# Altium schematic sheet Buck.SchDoc
size 985 x 607 mm
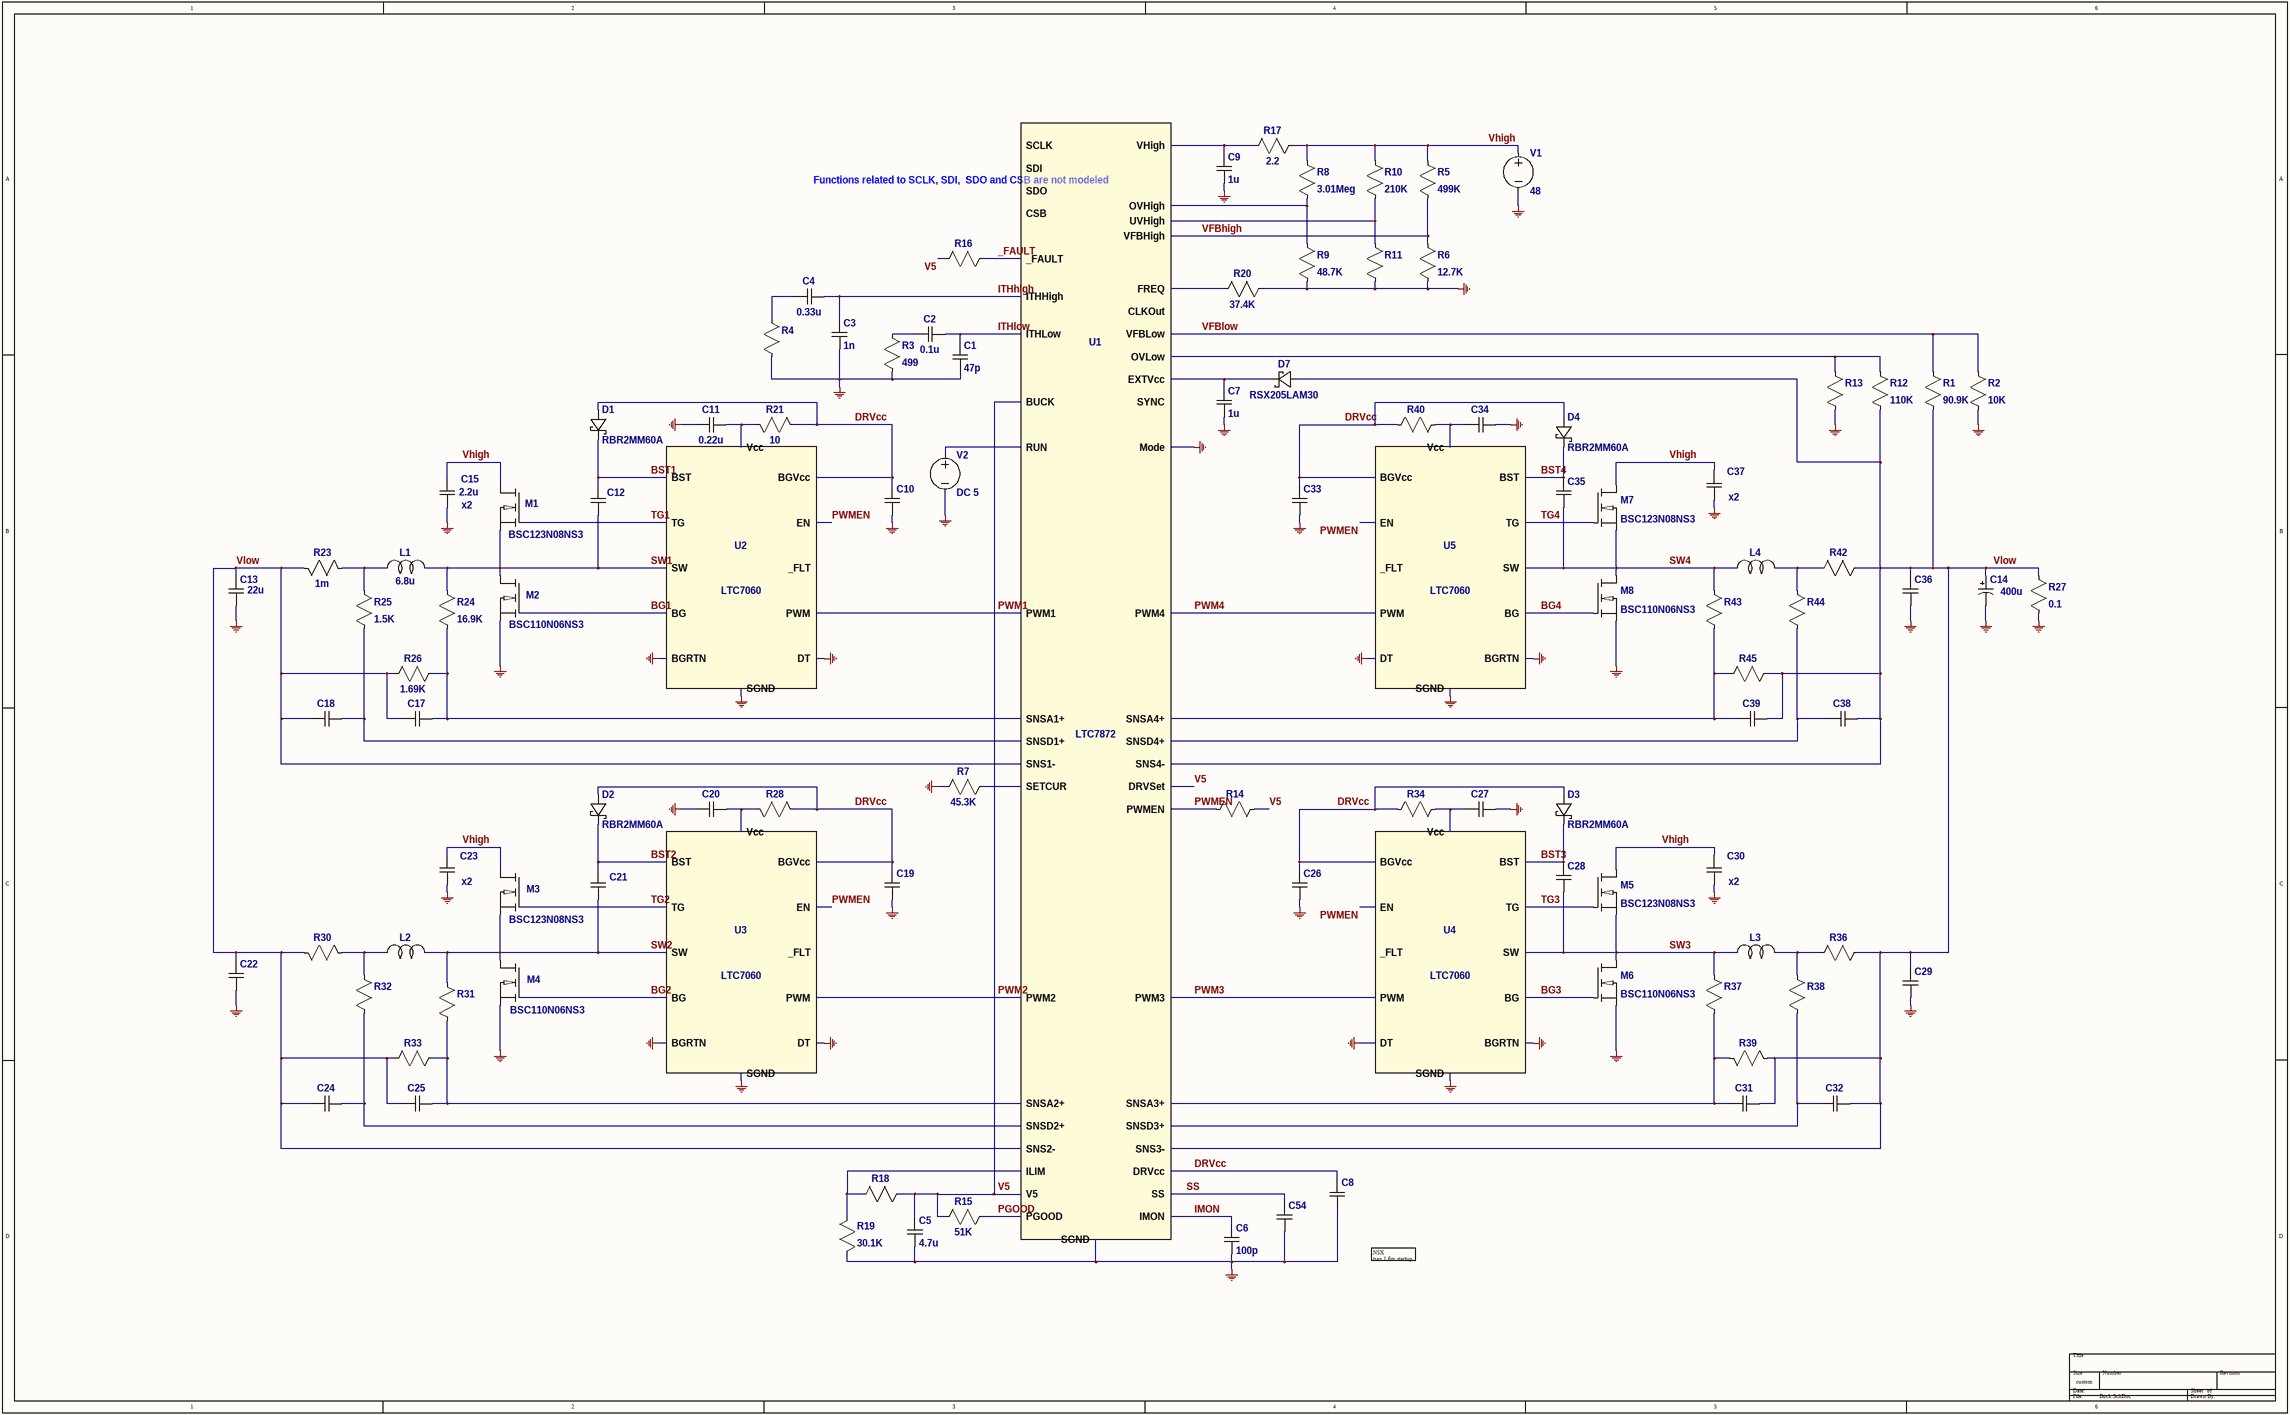
[diagram p0: Buck.SchDoc]

## Parts
C1  47p
C2  0.1u
C3  1n
C4  0.33u
C5  4.7u
C6  100p
C7  1u
C8  4.7u  (value not drawn)
C9  1u
C10  1u  (value not drawn)
C11  0.22u
C12  0.22u  (value not drawn)
C13  22u
C14  400u
C15  2.2u  Value2: x2
C17  0.1u  (value not drawn)
C18  0.1u  (value not drawn)
C19  1u  (value not drawn)
C20  0.22u  (value not drawn)
C21  0.22u  (value not drawn)
C22  22u  (value not drawn)
C23  Value2: x2  (hidden comment: 2.2u)
C24  0.1u  (value not drawn)
C25  0.1u  (value not drawn)
C26  1u  (value not drawn)
C27  0.22u  (value not drawn)
C28  0.22u  (value not drawn)
C29  22u  (value not drawn)
C30  Value2: x2  (hidden comment: 2.2u)
C31  0.1u  (value not drawn)
C32  0.1u  (value not drawn)
C33  1u  (value not drawn)
C34  0.22u  (value not drawn)
C35  0.22u  (value not drawn)
C36  22u  (value not drawn)
C37  Value2: x2  (hidden comment: 2.2u)
C38  0.1u  (value not drawn)
C39  0.1u  (value not drawn)
C54  1n  (value not drawn)
D1  RBR2MM60A
D2  RBR2MM60A
D3  RBR2MM60A
D4  RBR2MM60A
D7  RSX205LAM30
L1  6.8u
L2  6.8u  (value not drawn)
L3  6.8u  (value not drawn)
L4  6.8u  (value not drawn)
M1  BSC123N08NS3
M2  BSC110N06NS3
M3  BSC123N08NS3
M4  BSC110N06NS3
M5  BSC123N08NS3
M6  BSC110N06NS3
M7  BSC123N08NS3
M8  BSC110N06NS3
R1  90.9K
R2  10K
R3  499
R4  499  (value not drawn)
R5  499K
R6  12.7K
R7  45.3K
R8  3.01Meg
R9  48.7K
R10  210K
R11  10K  (value not drawn)
R12  110K
R13  10K  (value not drawn)
R14  10K  (value not drawn)
R15  51K
R16  51K  (value not drawn)
R17  2.2
R18  10K  (value not drawn)
R19  30.1K
R20  37.4K
R21  10
R23  1m
R24  16.9K
R25  1.5K
R26  1.69K
R27  0.1
R28  10  (value not drawn)
R30  1m  (value not drawn)
R31  16.9K  (value not drawn)
R32  1.5K  (value not drawn)
R33  1.69K  (value not drawn)
R34  10  (value not drawn)
R36  1m  (value not drawn)
R37  16.9K  (value not drawn)
R38  1.5K  (value not drawn)
R39  1.69K  (value not drawn)
R40  10  (value not drawn)
R42  1m  (value not drawn)
R43  16.9K  (value not drawn)
R44  1.5K  (value not drawn)
R45  1.69K  (value not drawn)
U1  LTC7872  [LXE_05-08-1832_ADI]
U2  LTC7060  [MSOP12_MSE_ADI]
U3  LTC7060  [MSOP12_MSE_ADI]
U4  LTC7060  [MSOP12_MSE_ADI]
U5  LTC7060  [MSOP12_MSE_ADI]
V1  48
V2  DC 5

## Nets
GND: C1.2(B) C3.2(B) C5.2(B) C6.2(B) C7.2(B) C8.2(B) C9.2(B) C10.2(B) C11.2(B) C13.2(B) C14.2(B) C15.2(B) C19.2(B) C20.2(B) C22.2(B) C23.2(B) C26.2(B) C27.2(B) C29.2(B) C30.2(B) C33.2(B) C34.2(B) C36.2(B) C37.2(B) C54.2(B) M2.3(S) M4.3(S) M6.3(S) M8.3(S) R2.2(B) R3.2(B) R4.2(B) R6.2(B) R7.2(B) R9.2(B) R11.2(B) R13.2(B) R19.1(A) R20.1(A) R27.2(B) U1.4(SGND) U1.37(Mode) U2.4(DT) U2.7(BGRTN) U2.12(SGND) U3.4(DT) U3.7(BGRTN) U3.12(SGND) U4.4(DT) U4.7(BGRTN) U4.12(SGND) U5.4(DT) U5.7(BGRTN) U5.12(SGND) V1.2(-) V2.2(-)
_FAULT: R16.1(A) U1.25(_FAULT)
BG1: M2.2(G) U2.8(BG)
BG2: M4.2(G) U3.8(BG)
BG3: M6.2(G) U4.8(BG)
BG4: M8.2(G) U5.8(BG)
BST1: C12.1(A) D1.2(-) U2.11(BST)
BST2: C21.1(A) D2.2(-) U3.11(BST)
BST3: C28.1(A) D3.2(-) U4.11(BST)
BST4: C35.1(A) D4.2(-) U5.11(BST)
DRVcc: C8.1(A) C10.1(A) C19.1(A) C26.1(A) C33.1(A) D1.1(+) D2.1(+) D3.1(+) D4.1(+) R21.1(A) R28.1(A) R34.1(A) R40.1(A) U1.33(DRVcc) U2.6(BGVcc) U3.6(BGVcc) U4.6(BGVcc) U5.6(BGVcc)
IMON: C6.1(A) U1.8(IMON)
ITHhigh: C3.1(A) C4.1(A) U1.5(ITHHigh)
ITHlow: C1.1(A) C2.1(A) U1.3(ITHLow)
PGOOD: R15.1(A) U1.22(PGOOD)
PWM1: U1.21(PWM1) U2.1(PWM)
PWM2: U1.23(PWM2) U3.1(PWM)
PWM3: U1.24(PWM3) U4.1(PWM)
PWM4: U1.26(PWM4) U5.1(PWM)
PWMEN: R14.1(A) U1.20(PWMEN) U2.2(EN) U3.2(EN) U4.2(EN) U5.2(EN)
SS: C54.1(A) U1.1(SS)
SW1: C12.2(B) L1.1(A) M1.3(S) M2.1(D) R24.1(A) U2.9(SW)
SW2: C21.2(B) L2.1(A) M3.3(S) M4.1(D) R31.1(A) U3.9(SW)
SW3: C28.2(B) L3.1(A) M5.3(S) M6.1(D) R37.1(A) U4.9(SW)
SW4: C35.2(B) L4.1(A) M7.3(S) M8.1(D) R43.1(A) U5.9(SW)
TG1: M1.2(G) U2.10(TG)
TG2: M3.2(G) U3.10(TG)
TG3: M5.2(G) U4.10(TG)
TG4: M7.2(G) U5.10(TG)
V5: C5.1(A) R14.2(B) R15.2(B) R16.2(B) R18.1(A) U1.7(V5) U1.32(DRVSet) U1.40(BUCK)
VFBhigh: R5.2(B) R6.1(A) U1.6(VFBHigh)
VFBlow: R1.1(A) R2.1(A) U1.2(VFBLow)
Vhigh: C15.1(A) C23.1(A) C30.1(A) C37.1(A) M1.1(D) M3.1(D) M5.1(D) M7.1(D) R5.1(A) R8.1(A) R10.1(A) R17.1(A) V1.1(+)
Vlow: C13.1(A) C14.1(A) C17.2(B) C18.2(B) C22.1(A) C24.2(B) C25.2(B) C29.1(A) C31.2(B) C32.2(B) C36.1(A) C38.1(A) C39.1(A) D7.1(+) R1.2(B) R12.2(B) R23.1(A) R26.2(B) R27.1(A) R30.1(A) R33.2(B) R36.1(A) R39.2(B) R42.1(A) R45.1(A) U1.14(SNS1-) U1.17(SNS2-) U1.42(SNS3-) U1.45(SNS4-)
NetC2_2: C2.2(B) R3.1(A)
NetC4_2: C4.2(B) R4.1(A)
NetC7_1: C7.1(A) D7.2(-) U1.31(EXTVcc)
NetC9_1: C9.1(A) R17.2(B) U1.34(VHigh)
NetC11_1: C11.1(A) R21.2(B) U2.5(Vcc)
NetC17_1: C17.1(A) R24.2(B) R26.1(A) U1.13(SNSA1+)
NetC18_1: C18.1(A) R25.2(B) U1.15(SNSD1+)
NetC20_1: C20.1(A) R28.2(B) U3.5(Vcc)
NetC24_1: C24.1(A) R32.2(B) U1.16(SNSD2+)
NetC25_1: C25.1(A) R31.2(B) R33.1(A) U1.18(SNSA2+)
NetC27_1: C27.1(A) R34.2(B) U4.5(Vcc)
NetC31_1: C31.1(A) R37.2(B) R39.1(A) U1.41(SNSA3+)
NetC32_1: C32.1(A) R38.2(B) U1.43(SNSD3+)
NetC34_1: C34.1(A) R40.2(B) U5.5(Vcc)
NetC38_2: C38.2(B) R44.2(B) U1.44(SNSD4+)
NetC39_2: C39.2(B) R43.2(B) R45.2(B) U1.46(SNSA4+)
NetL1_2: L1.2(B) R23.2(B) R25.1(A)
NetL2_2: L2.2(B) R30.2(B) R32.1(A)
NetL3_2: L3.2(B) R36.2(B) R38.1(A)
NetL4_2: L4.2(B) R42.2(B) R44.1(A)
NetR7_1: R7.1(A) U1.9(SETCUR)
NetR8_2: R8.2(B) R9.1(A) U1.10(OVHigh)
NetR10_2: R10.2(B) R11.1(A) U1.11(UVHigh)
NetR12_1: R12.1(A) R13.1(A) U1.12(OVLow)
NetR18_2: R18.2(B) R19.2(B) U1.35(ILIM)
NetR20_2: R20.2(B) U1.39(FREQ)
NetU1_19: U1.19(RUN) V2.1(+)

Not connected (* = marked no-connect by the designer): U1 27(CSB) 28(SDO) 29(SDI) 30(SCLK) 36(CLKOut) 38(SYNC); U2 3(_FLT); U3 3(_FLT); U4 3(_FLT); U5 3(_FLT)

## Notes on the sheet
- (near U1) Functions related to SCLK, SDI,
  SDO and CSB are not modeled
- .NSX
  .tran 1.6m startup

## Library data of the parts
C1 = cap-47p: InstName: C1; Prefix: C; Value: 47p
C2 = cap-0.1u: InstName: C2; Prefix: C; Value: 0.1u
C3 = cap-1n: InstName: C3; Prefix: C; Value: 1n
C4 = cap-0.33u: InstName: C4; Prefix: C; Value: 0.33u
C5 = cap-4.7u: InstName: C5; Prefix: C; Value: 4.7u
C6 = cap-100p: InstName: C6; Prefix: C; Value: 100p
C7 = cap-1u: InstName: C7; Prefix: C; Value: 1u
C8 = cap-4.7u: InstName: C8; Prefix: C; Value: 4.7u
C9 = cap-1u: InstName: C9; Prefix: C; Value: 1u
C10 = cap-1u: InstName: C10; Prefix: C; Value: 1u
C11 = cap-0.22u: InstName: C11; Prefix: C; Value: 0.22u
C12 = cap-0.22u: InstName: C12; Prefix: C; Value: 0.22u
C13 = cap-22u: InstName: C13; Prefix: C; Value: 22u; SpiceLine: Rser=2m
C14 = polcap-400u: InstName: C14; Prefix: C; Description: Capacitor; Type: cap; Value: 400u; SpiceLine: Rser=0.015
C15 = cap-2.2u: InstName: C15; Prefix: C; Value: 2.2u; SpiceLine: Rser=0.014
C17 = cap-0.1u: InstName: C17; Prefix: C; Value: 0.1u
C18 = cap-0.1u: InstName: C18; Prefix: C; Value: 0.1u
C19 = cap-1u: InstName: C19; Prefix: C; Value: 1u
C20 = cap-0.22u: InstName: C20; Prefix: C; Value: 0.22u
C21 = cap-0.22u: InstName: C21; Prefix: C; Value: 0.22u
C22 = cap-22u: InstName: C22; Prefix: C; Value: 22u; SpiceLine: Rser=2m
C23 = cap-2.2u: InstName: C23; Prefix: C; Value: 2.2u; SpiceLine: Rser=0.014
C24 = cap-0.1u: InstName: C24; Prefix: C; Value: 0.1u
C25 = cap-0.1u: InstName: C25; Prefix: C; Value: 0.1u
C26 = cap-1u: InstName: C26; Prefix: C; Value: 1u
C27 = cap-0.22u: InstName: C27; Prefix: C; Value: 0.22u
C28 = cap-0.22u: InstName: C28; Prefix: C; Value: 0.22u
C29 = cap-22u: InstName: C29; Prefix: C; Value: 22u; SpiceLine: Rser=2m
C30 = cap-2.2u: InstName: C30; Prefix: C; Value: 2.2u; SpiceLine: Rser=0.014
C31 = cap-0.1u: InstName: C31; Prefix: C; Value: 0.1u
C32 = cap-0.1u: InstName: C32; Prefix: C; Value: 0.1u
C33 = cap-1u: InstName: C33; Prefix: C; Value: 1u
C34 = cap-0.22u: InstName: C34; Prefix: C; Value: 0.22u
C35 = cap-0.22u: InstName: C35; Prefix: C; Value: 0.22u
C36 = cap-22u: InstName: C36; Prefix: C; Value: 22u; SpiceLine: Rser=2m
C37 = cap-2.2u: InstName: C37; Prefix: C; Value: 2.2u; SpiceLine: Rser=0.014
C38 = cap-0.1u: InstName: C38; Prefix: C; Value: 0.1u
C39 = cap-0.1u: InstName: C39; Prefix: C; Value: 0.1u
C54 = cap-1n: InstName: C54; Prefix: C; Value: 1n
D1 = schottky-RBR2MM60A: InstName: D1; Prefix: D; Description: Diode; Value: RBR2MM60A; Type: diode
D2 = schottky-RBR2MM60A: InstName: D2; Prefix: D; Description: Diode; Value: RBR2MM60A; Type: diode
D3 = schottky-RBR2MM60A: InstName: D3; Prefix: D; Description: Diode; Value: RBR2MM60A; Type: diode
D4 = schottky-RBR2MM60A: InstName: D4; Prefix: D; Description: Diode; Value: RBR2MM60A; Type: diode
D7 = schottky-RSX205LAM30: InstName: D7; Prefix: D; Description: Diode; Value: RSX205LAM30; Type: diode
L1 = ind-6.8u: InstName: L1; Prefix: L; Value: 6.8u; SpiceLine: Rser=1m
L2 = ind-6.8u: InstName: L2; Prefix: L; Value: 6.8u; SpiceLine: Rser=1m
L3 = ind-6.8u: InstName: L3; Prefix: L; Value: 6.8u; SpiceLine: Rser=1m
L4 = ind-6.8u: InstName: L4; Prefix: L; Value: 6.8u; SpiceLine: Rser=1m
M1 = NMOS-BSC123N08NS3: InstName: M1; Prefix: MN; Value: BSC123N08NS3
M2 = NMOS-BSC110N06NS3: InstName: M2; Prefix: MN; Value: BSC110N06NS3
M3 = NMOS-BSC123N08NS3: InstName: M3; Prefix: MN; Value: BSC123N08NS3
M4 = NMOS-BSC110N06NS3: InstName: M4; Prefix: MN; Value: BSC110N06NS3
M5 = NMOS-BSC123N08NS3: InstName: M5; Prefix: MN; Value: BSC123N08NS3
M6 = NMOS-BSC110N06NS3: InstName: M6; Prefix: MN; Value: BSC110N06NS3
M7 = NMOS-BSC123N08NS3: InstName: M7; Prefix: MN; Value: BSC123N08NS3
M8 = NMOS-BSC110N06NS3: InstName: M8; Prefix: MN; Value: BSC110N06NS3
R1 = res-90.9K: InstName: R1; Prefix: R; Value: 90.9K
R2 = res-10K: InstName: R2; Prefix: R; Value: 10K
R3 = res-499: InstName: R3; Prefix: R; Value: 499
R4 = res-499: InstName: R4; Prefix: R; Value: 499
R5 = res-499K: InstName: R5; Prefix: R; Value: 499K
R6 = res-12.7K: InstName: R6; Prefix: R; Value: 12.7K
R7 = res-45.3K: InstName: R7; Prefix: R; Value: 45.3K
R8 = res-3.01Meg: InstName: R8; Prefix: R; Value: 3.01Meg
R9 = res-48.7K: InstName: R9; Prefix: R; Value: 48.7K
R10 = res-210K: InstName: R10; Prefix: R; Value: 210K
R11 = res-10K: InstName: R11; Prefix: R; Value: 10K
R12 = res-110K: InstName: R12; Prefix: R; Value: 110K
R13 = res-10K: InstName: R13; Prefix: R; Value: 10K
R14 = res-10K: InstName: R14; Prefix: R; Value: 10K
R15 = res-51K: InstName: R15; Prefix: R; Value: 51K
R16 = res-51K: InstName: R16; Prefix: R; Value: 51K
R17 = res-2.2: InstName: R17; Prefix: R; Value: 2.2
R18 = res-10K: InstName: R18; Prefix: R; Value: 10K
R19 = res-30.1K: InstName: R19; Prefix: R; Value: 30.1K
R20 = res-37.4K: InstName: R20; Prefix: R; Value: 37.4K
R21 = res-10: InstName: R21; Prefix: R; Value: 10
R23 = res-1m: InstName: R23; Prefix: R; Value: 1m
R24 = res-16.9K: InstName: R24; Prefix: R; Value: 16.9K
R25 = res-1.5K: InstName: R25; Prefix: R; Value: 1.5K
R26 = res-1.69K: InstName: R26; Prefix: R; Value: 1.69K
R27 = res-0.1: InstName: R27; Prefix: R; Value: 0.1
R28 = res-10: InstName: R28; Prefix: R; Value: 10
R30 = res-1m: InstName: R30; Prefix: R; Value: 1m
R31 = res-16.9K: InstName: R31; Prefix: R; Value: 16.9K
R32 = res-1.5K: InstName: R32; Prefix: R; Value: 1.5K
R33 = res-1.69K: InstName: R33; Prefix: R; Value: 1.69K
R34 = res-10: InstName: R34; Prefix: R; Value: 10
R36 = res-1m: InstName: R36; Prefix: R; Value: 1m
R37 = res-16.9K: InstName: R37; Prefix: R; Value: 16.9K
R38 = res-1.5K: InstName: R38; Prefix: R; Value: 1.5K
R39 = res-1.69K: InstName: R39; Prefix: R; Value: 1.69K
R40 = res-10: InstName: R40; Prefix: R; Value: 10
R42 = res-1m: InstName: R42; Prefix: R; Value: 1m
R43 = res-16.9K: InstName: R43; Prefix: R; Value: 16.9K
R44 = res-1.5K: InstName: R44; Prefix: R; Value: 1.5K
R45 = res-1.69K: InstName: R45; Prefix: R; Value: 1.69K
U1 = LTC7872: InstName: U1; Prefix: X; Value: LTC7872; SpiceModel: LTC7872.sub; Value2: LTC7872
U2 = LTC7060: InstName: U2; Prefix: X; Value: LTC7060; SpiceModel: LTC7060.sub; Value2: LTC7060
U3 = LTC7060: InstName: U3; Prefix: X; Value: LTC7060; SpiceModel: LTC7060.sub; Value2: LTC7060
U4 = LTC7060: InstName: U4; Prefix: X; Value: LTC7060; SpiceModel: LTC7060.sub; Value2: LTC7060
U5 = LTC7060: InstName: U5; Prefix: X; Value: LTC7060; SpiceModel: LTC7060.sub; Value2: LTC7060
V1 = voltage-48: voltage source; InstName: V1; Prefix: V; Value: 48
V2 = voltage-48: voltage source; InstName: V1; Value: 5; Prefix: V; AC Magnitude: 1; AC Phase: 0